# EAGLE design brick_i2c_9axis_MPU9250_mini (EAGLE 7.4.0)
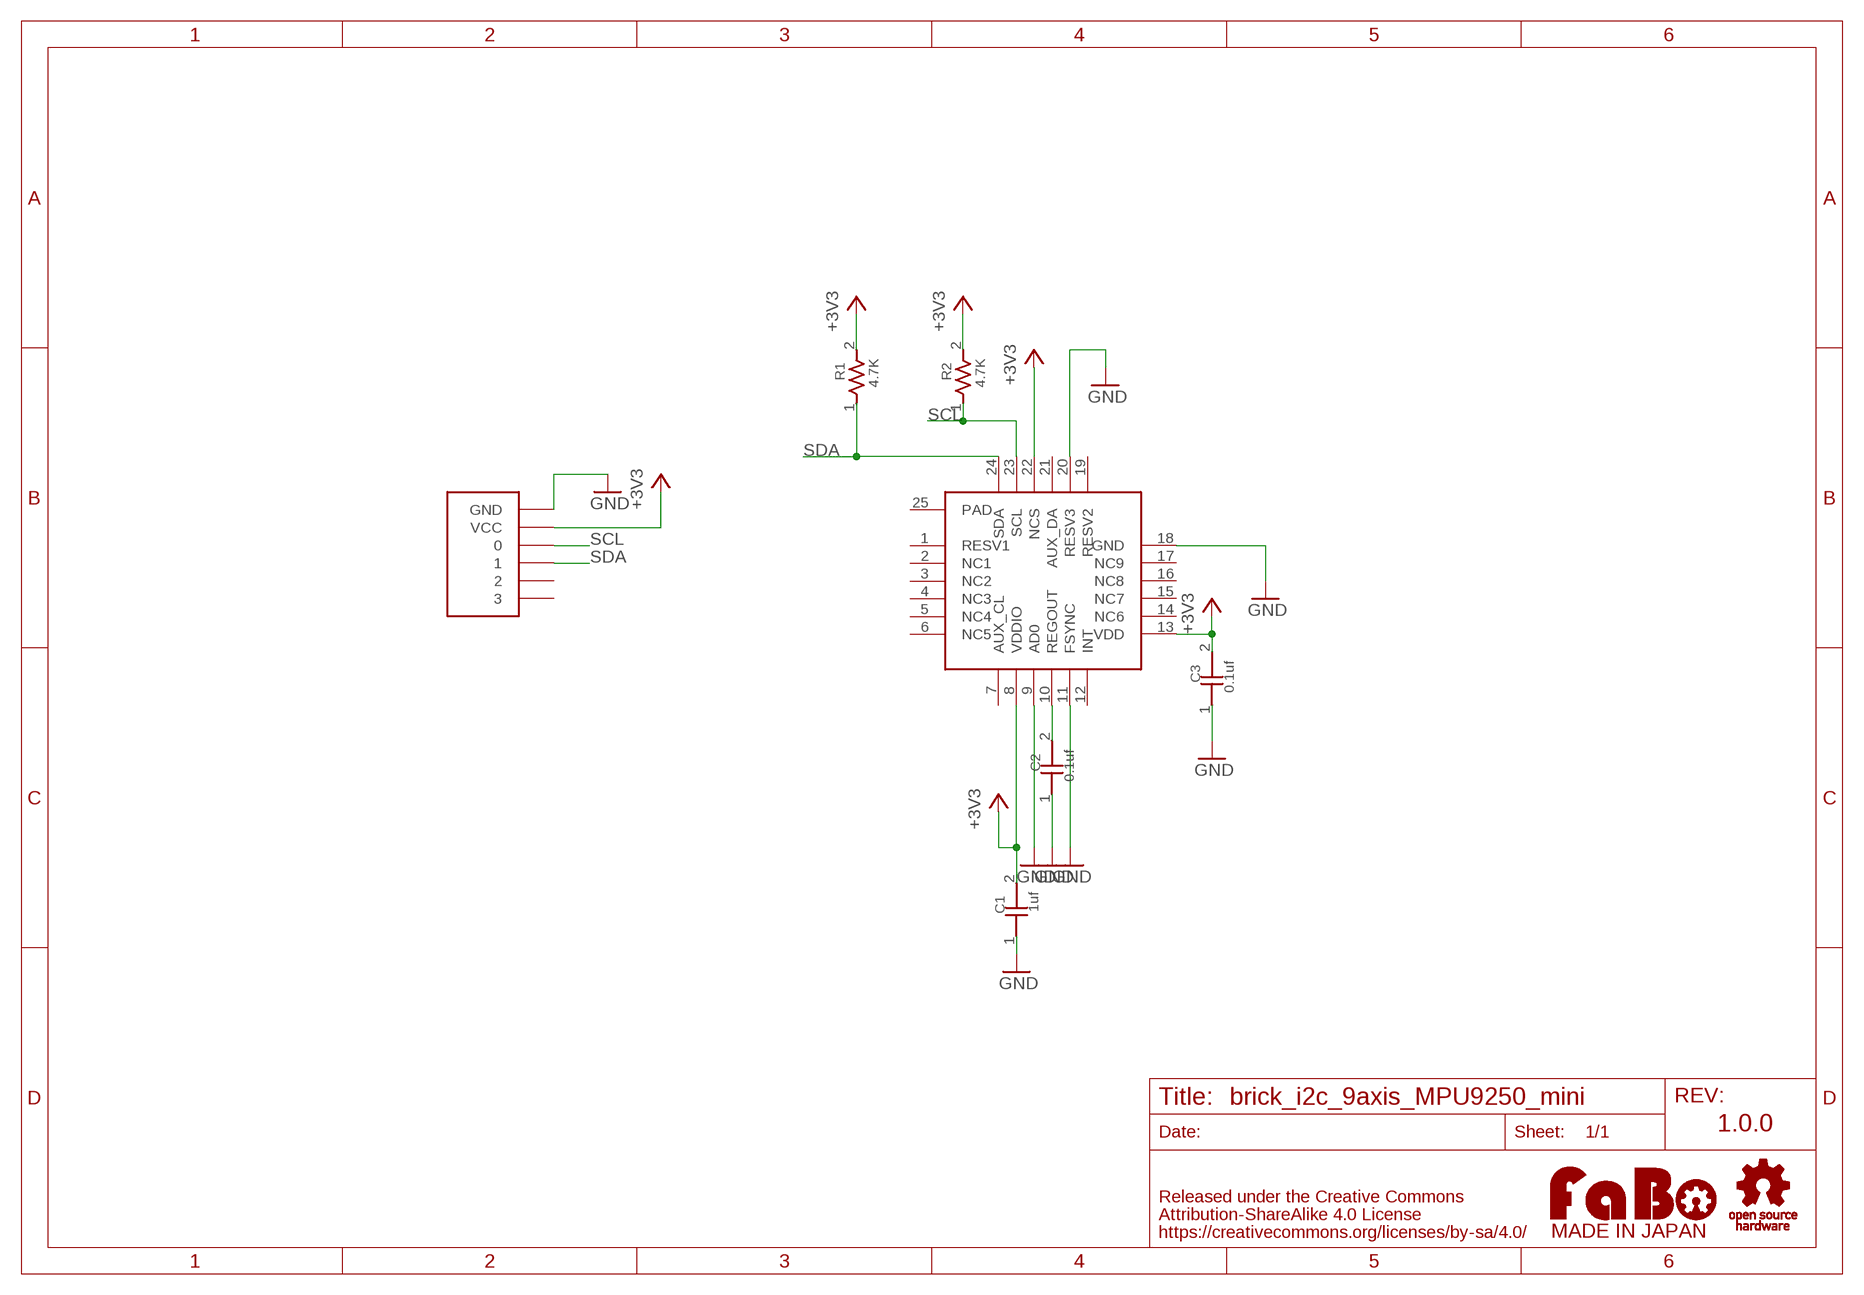
[diagram p0: schematic, sheet 1]

## Parts
C1  1uf  CAPACITOR0603  [0603]
C2  0.1uf  CAPACITOR0603  [0603]
C3  0.1uf  CAPACITOR0603  [0603]
R1  4.7K  RESISTOR0603  [0603]
R2  4.7K  RESISTOR0603  [0603]
U$1  INVENSENSE-MPU9250  [LGA-24]
U$3  LOGO_OSHW-S_BOTTOM  [LOGO_OSHW_S_BOTTOM]
U$4  FABO-NANO  [FABO-NANO]
U$5  LOGO_FABO-S_BOTTOM  [LOGO_FABO_S_BOTTOM]

## Nets
+3V3: C1.2 C3.2 R1.2 R2.2 U$1.8(VDDIO) U$1.13(VDD) U$1.22(NCS) U$4.VCC
GND: C1.1 C2.1 C3.1 U$1.9(AD0) U$1.11(FSYNC) U$1.18(GND) U$1.20(RESV3) U$4.GND
N$3: C2.2 U$1.10(REGOUT)
SCL: R2.1 U$1.23(SCL) U$4.0
SDA: R1.1 U$1.24(SDA) U$4.1
Unconnected: U$1.1(RESV1) U$1.2(NC1) U$1.3(NC2) U$1.4(NC3) U$1.5(NC4) U$1.6(NC5) U$1.7(AUX_CL) U$1.12(INT) U$1.14(NC6) U$1.15(NC7) U$1.16(NC8) U$1.17(NC9) U$1.19(RESV2) U$1.21(AUX_DA) U$1.25(PAD) U$4.2 U$4.3

## Notes on the sheet
- 1.0.0

## Library data of the parts
C1-C3 = GClue-Capacitor:CAPACITOR
R1 R2 = GClue-Resistors:RESISTOR
U$1 = GClue-Mems:INVENSENSE-MPU9250
U$3 = FaBo-etc:LOGO_OSHW
U$4 = FaBo-Template:FABO-NANO
U$5 = FaBo-etc:LOGO_FABO

## Board
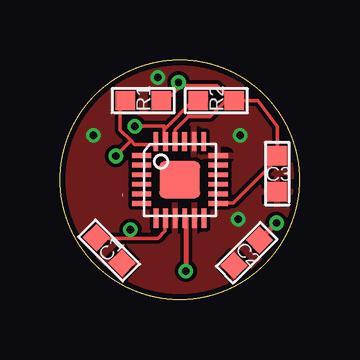
[diagram p1: board, top side]
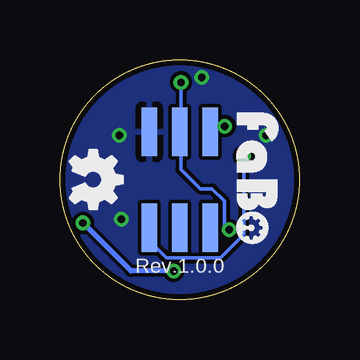
[diagram p2: board, bottom side, seen from below]

Size 10 x 10 mm. Coordinates in mm from the lower left corner, seen from the top.
Copper layers (1*16): Top 0.035mm / dielectric 1.5mm / Bottom 0.035mm
Design rules "SeeedStudio_2layer_DRU_no_angle_20140221": minimum track width 6mil, minimum drill 12mil, track to track 6mil, track to pad 6mil, pad to pad 6mil, via to via 6mil, smd to smd 0mil, copper to edge 10mil, drill to drill 10mil, minimum pad ring 10mil, minimum via ring 6mil, stop-mask expansion 2mil, vias tented up to drill 100mil, thermal gap 10mil

### Footprints (pad centres in the part's own frame; a part is rotated, then mirrored left to right if it is on the bottom)
0603 = smd 0.8 x 0.8: 1 -0.75,0; 2 0.75,0
LGA-24 = smd 0.8 x 0.2: 1 -1.6,1.01; 2 -1.6,0.61; 3 -1.6,0.21; 4 -1.6,-0.19; 5 -1.6,-0.59; 6 -1.6,-0.99; 13 1.6,-0.99; 14 1.6,-0.59; 15 1.6,-0.19; 16 1.6,0.21; 17 1.6,0.61; 18 1.6,1.01 | smd 0.2 x 0.8: 7 -0.99,-1.6; 8 -0.59,-1.6; 9 -0.19,-1.6; 10 0.21,-1.6; 11 0.61,-1.6; 12 1.01,-1.6; 19 1,1.6; 20 0.6,1.6; 21 0.2,1.6; 22 -0.2,1.6; 23 -0.6,1.6; 24 -1,1.6 | smd 1.7 x 1.55: 25 0,0
FABO-NANO = smd 0.635 x 2.032 bottom: 0 -1.27,2; 1 1.27,-2; 2 0,-2; 3 -1.27,-2; GND 1.27,2; VCC 0,2

### Placement (x,y rotation side)
C1  2.05,2.05 135 top
C2  7.79,1.95 45 top
C3  9.06,5.25 90 top
R1  3.48,8.3 0 top
R2  6.52,8.3 0 top
U$1  5,5 0 top
U$3  8.61,5 90 top
U$4  5,5 0 top
U$5  2.64,5 90 top

### Tracks (layer width: path | path; a pad name or v marks a point on that pad's centre or on a via)
+3V3  (via drill 0.3)
  Top 0.152: U$1.13 6.63,4.04 7.24,4.04 9.06,5.86 C3.2 9.06,7.21 8.25,8.3 R2.2 | 2.97,2.56 4.09,2.56 4.39,2.87 4.39,3.32 U$1.8 | 2.97,2.56 1.98,2.56 C1.2 | R1.2 4.42,8.3 5.08,8.94 | 5.08,8.94 6.55,8.94 7.08,8.45 | 7.08,8.45 7.24,8.3 R2.2 | 7.08,8.45 6.27,7.64 5.36,7.64 4.8,7.08 4.8,6.63 U$1.22 | 7.08,8.45 R2.2 | 5.08,8.94 v4.95,9.06 | v2.94,2.92 2.97,2.56
  Bottom 0.152: v4.95,9.06 4.95,7.08 U$4.VCC 4.95,6.93 4.95,5.43 4.14,4.62 3.65,4.62 3.15,4.11 3.15,3.12 v2.94,2.92
GND  (via drill 0.3)
  other vias: 1.39,6.85 7.51,6.85 7.44,3.35 4.09,9.27
  pour Bottom: -1.35,-1.35 11.35,-1.35 11.35,11.35 -1.35,11.35
  pour Top: -1.35,-1.35 11.35,-1.35 11.35,11.35 -1.35,11.35
N$3  (via drill 0.3)
  Top 0.203: U$1.10 5.25,3.4 v5.25,1.19 | v9.04,3.2 C2.2
  Bottom 0.203: v5.25,1.19 7.03,1.19 v9.04,3.2
SCL  (via drill 0.3)
  Top 0.152: 4.34,7.08 4.34,6.63 U$1.23 | 4.34,7.08 5.56,8.3 R2.1 | 4.34,7.08 4.34,7.24 v3.12,7.24
  Bottom 0.152: v3.12,7.24 3.73,7.24 3.88,7.08 U$4.0
SDA  (via drill 0.3)
  Top 0.152: 2.97,6.63 2.51,7.08 2.51,8.15 2.66,8.3 R1.1 | 2.97,6.63 3.12,6.47 4.04,6.47 U$1.24 | v2.33,5.99 2.97,6.63
  Bottom 0.152: v2.33,5.99 2.33,2.71 3.3,1.75 5.56,1.75 6.17,2.36 6.17,2.97 U$4.1

### Text on the board
bPlace: Rev.1.0.0